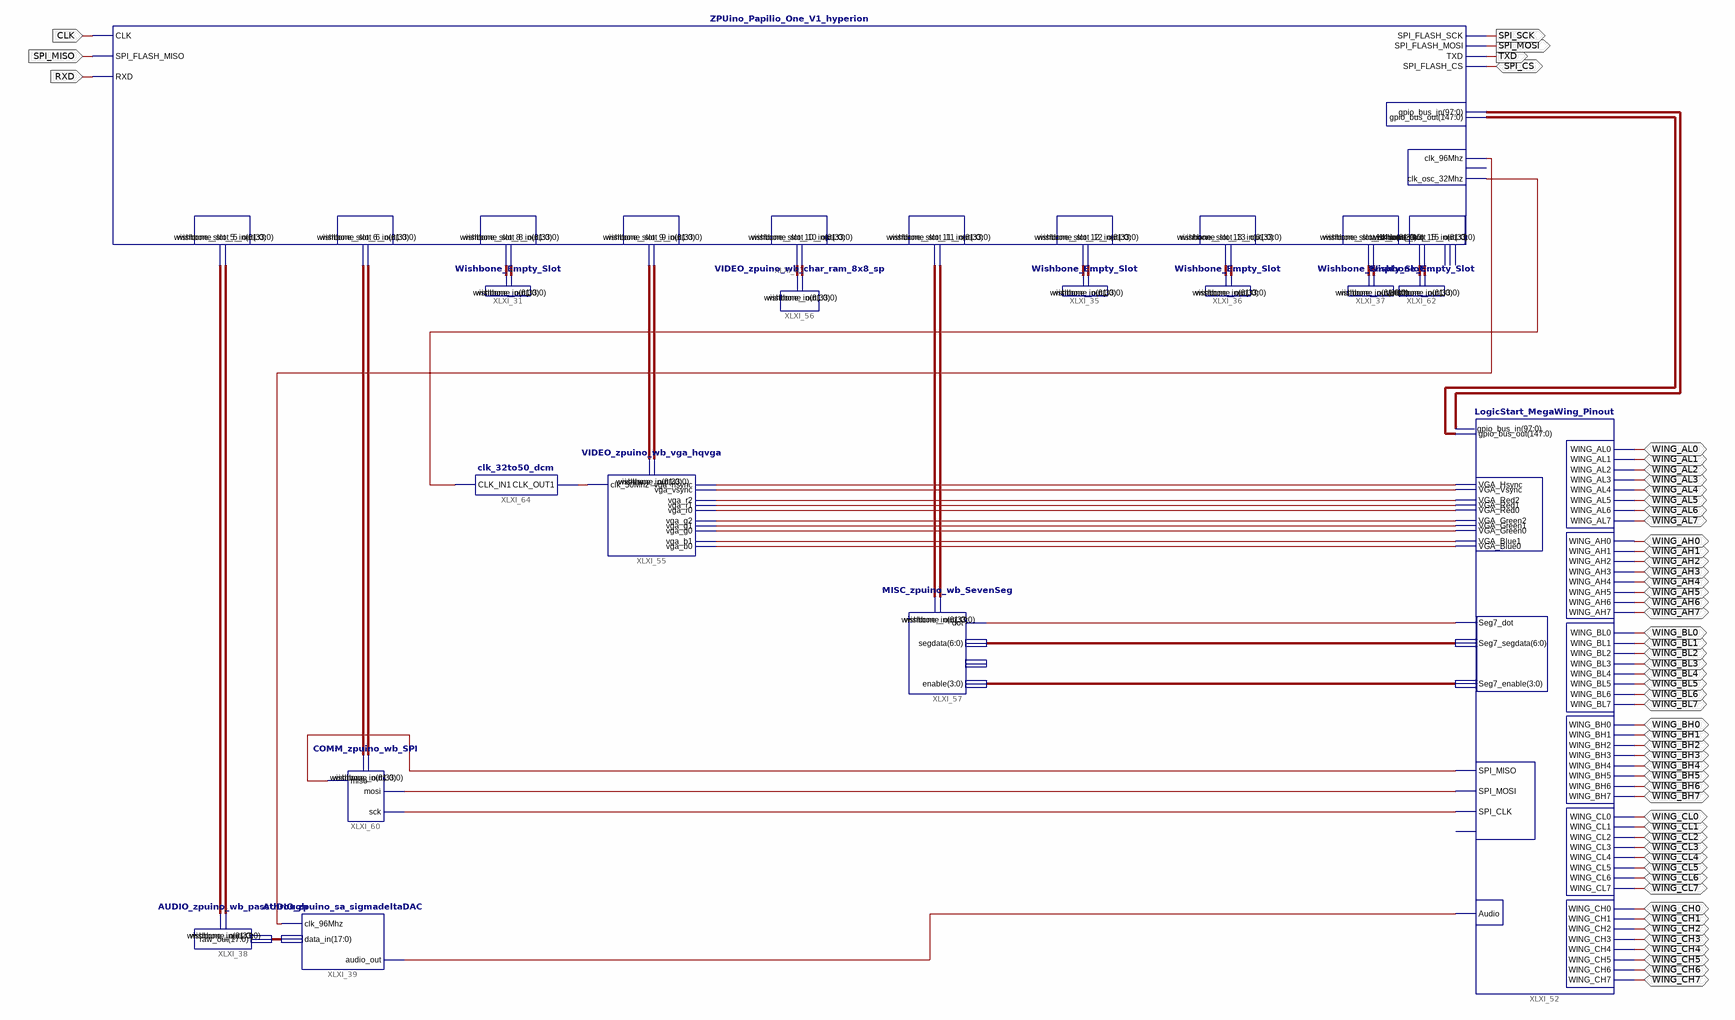
[diagram p0: schematic sheet 1]
// Xilinx ISE schematic Papilio_One_500K.sch (spartan3e) as structural Verilog: 14 symbols, 55 ports
module Papilio_One_500K (
  input  RXD,
  input  SPI_MISO,
  input  CLK,
  inout  SPI_CS,
  inout  WING_CH7,
  inout  WING_CH6,
  inout  WING_CH5,
  inout  WING_CH4,
  inout  WING_CH3,
  inout  WING_CH2,
  inout  WING_CH1,
  inout  WING_CH0,
  inout  WING_CL7,
  inout  WING_CL6,
  inout  WING_CL5,
  inout  WING_CL4,
  inout  WING_CL3,
  inout  WING_CL2,
  inout  WING_CL1,
  inout  WING_CL0,
  inout  WING_BH7,
  inout  WING_BH6,
  inout  WING_BH5,
  inout  WING_BH4,
  inout  WING_BH3,
  inout  WING_BH2,
  inout  WING_BH1,
  inout  WING_BH0,
  inout  WING_BL7,
  inout  WING_BL6,
  inout  WING_BL5,
  inout  WING_BL4,
  inout  WING_BL3,
  inout  WING_BL2,
  inout  WING_BL1,
  inout  WING_BL0,
  inout  WING_AH7,
  inout  WING_AH6,
  inout  WING_AH5,
  inout  WING_AH4,
  inout  WING_AH3,
  inout  WING_AH2,
  inout  WING_AH1,
  inout  WING_AH0,
  inout  WING_AL7,
  inout  WING_AL6,
  inout  WING_AL5,
  inout  WING_AL4,
  inout  WING_AL3,
  inout  WING_AL2,
  inout  WING_AL1,
  inout  WING_AL0,
  output TXD,
  output SPI_MOSI,
  output SPI_SCK
);

  wire XLXN_452, XLXN_544, XLXN_549, XLXN_553, XLXN_554, XLXN_555, XLXN_567, XLXN_568, XLXN_569, XLXN_570,
       XLXN_571, XLXN_572, XLXN_573, XLXN_574, XLXN_575, XLXN_576, XLXN_577, XLXN_588;
  wire [3:0] XLXN_543;
  wire [6:0] XLXN_542;
  wire [17:0] XLXN_450;
  wire [33:0] XLXN_431, XLXN_433, XLXN_435, XLXN_443, XLXN_449, XLXN_537, XLXN_541, XLXN_546, XLXN_560,
       XLXN_566;
  wire [61:0] XLXN_430, XLXN_432, XLXN_434, XLXN_442, XLXN_448, XLXN_536, XLXN_540, XLXN_545, XLXN_559,
       XLXN_565;
  wire [97:0] XLXN_409;
  wire [147:0] XLXN_408;

  Wishbone_Empty_Slot XLXI_37 (.wishbone_in(XLXN_430), .wishbone_out(XLXN_431));
  Wishbone_Empty_Slot XLXI_36 (.wishbone_in(XLXN_432), .wishbone_out(XLXN_433));
  Wishbone_Empty_Slot XLXI_35 (.wishbone_in(XLXN_434), .wishbone_out(XLXN_435));
  Wishbone_Empty_Slot XLXI_31 (.wishbone_in(XLXN_442), .wishbone_out(XLXN_443));
  LogicStart_MegaWing_Pinout XLXI_52 (
    .gpio_bus_out(XLXN_408), .gpio_bus_in(XLXN_409), .WING_AL0(WING_AL0), .WING_AL1(WING_AL1),
    .WING_AL2(WING_AL2), .WING_AL3(WING_AL3), .WING_AL4(WING_AL4), .WING_AL5(WING_AL5), .WING_AL6(WING_AL6),
    .WING_AL7(WING_AL7), .WING_AH0(WING_AH0), .WING_AH1(WING_AH1), .WING_AH2(WING_AH2), .WING_AH3(WING_AH3),
    .WING_AH4(WING_AH4), .WING_AH5(WING_AH5), .WING_AH6(WING_AH6), .WING_AH7(WING_AH7), .WING_BL0(WING_BL0),
    .WING_BL1(WING_BL1), .WING_BL2(WING_BL2), .WING_BL3(WING_BL3), .WING_BL4(WING_BL4), .WING_BL5(WING_BL5),
    .WING_BL6(WING_BL6), .WING_BL7(WING_BL7), .WING_BH0(WING_BH0), .WING_BH1(WING_BH1), .WING_BH2(WING_BH2),
    .WING_BH3(WING_BH3), .WING_BH4(WING_BH4), .WING_BH5(WING_BH5), .WING_BH6(WING_BH6), .WING_BH7(WING_BH7),
    .WING_CL0(WING_CL0), .WING_CL1(WING_CL1), .WING_CL2(WING_CL2), .WING_CL3(WING_CL3), .WING_CL4(WING_CL4),
    .WING_CL5(WING_CL5), .WING_CL6(WING_CL6), .WING_CL7(WING_CL7), .WING_CH0(WING_CH0), .WING_CH1(WING_CH1),
    .WING_CH2(WING_CH2), .WING_CH3(WING_CH3), .WING_CH4(WING_CH4), .WING_CH5(WING_CH5), .WING_CH6(WING_CH6),
    .WING_CH7(WING_CH7), .VGA_Red2(XLXN_569), .VGA_Red1(XLXN_570), .VGA_Red0(XLXN_571),
    .VGA_Green2(XLXN_572), .VGA_Green1(XLXN_573), .VGA_Green0(XLXN_574), .VGA_Blue1(XLXN_575),
    .VGA_Blue0(XLXN_576), .VGA_Hsync(XLXN_567), .VGA_Vsync(XLXN_568), .Audio(XLXN_588), .SPI_MISO(XLXN_555),
    .SPI_MOSI(XLXN_554), .SPI_CLK(XLXN_553), .Seg7_dot(XLXN_544), .Seg7_enable(XLXN_543),
    .Seg7_segdata(XLXN_542));  // open: SPI_CS
  VIDEO_zpuino_wb_char_ram_8x8_sp XLXI_56 (.wishbone_in(XLXN_540), .wishbone_out(XLXN_541));
  AUDIO_zpuino_wb_passthrough XLXI_38 (.raw_out(XLXN_450), .wishbone_in(XLXN_448), .wishbone_out(XLXN_449));
  AUDIO_zpuino_sa_sigmadeltaDAC XLXI_39 (.data_in(XLXN_450), .audio_out(XLXN_588), .clk_96Mhz(XLXN_452));
  Wishbone_Empty_Slot XLXI_62 (.wishbone_in(XLXN_565), .wishbone_out(XLXN_566));
  ZPUino_Papilio_One_V1_hyperion XLXI_63 (
    .clk_96Mhz(XLXN_452), .clk_osc_32Mhz(XLXN_549), .wishbone_slot_15_in(XLXN_565),
    .wishbone_slot_15_out(XLXN_566), .wishbone_slot_14_in(XLXN_430), .wishbone_slot_14_out(XLXN_431),
    .wishbone_slot_13_in(XLXN_432), .wishbone_slot_13_out(XLXN_433), .wishbone_slot_12_in(XLXN_434),
    .wishbone_slot_12_out(XLXN_435), .wishbone_slot_11_in(XLXN_545), .wishbone_slot_11_out(XLXN_546),
    .wishbone_slot_10_in(XLXN_540), .wishbone_slot_10_out(XLXN_541), .wishbone_slot_9_in(XLXN_536),
    .wishbone_slot_9_out(XLXN_537), .wishbone_slot_8_in(XLXN_442), .wishbone_slot_8_out(XLXN_443),
    .wishbone_slot_6_in(XLXN_559), .wishbone_slot_6_out(XLXN_560), .wishbone_slot_5_out(XLXN_449),
    .wishbone_slot_5_in(XLXN_448), .CLK(CLK), .SPI_FLASH_MISO(SPI_MISO), .RXD(RXD), .SPI_FLASH_SCK(SPI_SCK),
    .SPI_FLASH_MOSI(SPI_MOSI), .TXD(TXD), .SPI_FLASH_CS(SPI_CS), .gpio_bus_out(XLXN_408),
    .gpio_bus_in(XLXN_409));  // open: clk_1Mhz, wishbone_slot_video_in, wishbone_slot_video_out, vgaclkout
  VIDEO_zpuino_wb_vga_hqvga XLXI_55 (
    .clk_50Mhz(XLXN_577), .vga_hsync(XLXN_567), .vga_vsync(XLXN_568), .vga_r2(XLXN_569), .vga_r1(XLXN_570),
    .vga_r0(XLXN_571), .vga_g2(XLXN_572), .vga_g1(XLXN_573), .vga_g0(XLXN_574), .vga_b1(XLXN_575),
    .vga_b0(XLXN_576), .wishbone_in(XLXN_536), .wishbone_out(XLXN_537));
  MISC_zpuino_wb_SevenSeg XLXI_57 (
    .segdata(XLXN_542), .enable(XLXN_543), .dot(XLXN_544), .wishbone_in(XLXN_545), .wishbone_out(XLXN_546));  // open: extra
  COMM_zpuino_wb_SPI XLXI_60 (
    .miso(XLXN_555), .sck(XLXN_553), .mosi(XLXN_554), .wishbone_in(XLXN_559), .wishbone_out(XLXN_560));
  clk_32to50_dcm XLXI_64 (.CLK_IN1(XLXN_549), .CLK_OUT1(XLXN_577));
endmodule
